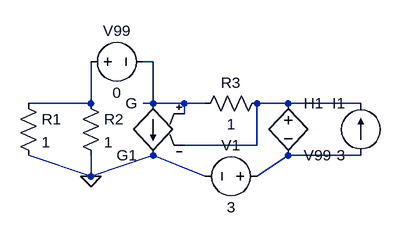
[diagram p0: schematic CCVS.asc]
CCVS.asc, the LTspice schematic file:
Version 4
SHEET 1 880 680
WIRE 208 32 192 32
WIRE 112 96 112 32
WIRE 112 96 16 96
WIRE 208 96 208 32
WIRE 208 96 192 96
WIRE 256 96 208 96
WIRE 288 96 256 96
WIRE 416 96 368 96
WIRE 528 96 416 96
WIRE 256 112 256 96
WIRE 368 160 368 96
WIRE 368 160 256 160
WIRE 528 176 416 176
WIRE 112 208 16 176
WIRE 112 208 112 176
WIRE 112 208 208 176
WIRE 288 208 208 176
WIRE 368 208 416 176
FLAG 112 208 0
SYMBOL res 0 80 R0
SYMATTR InstName R1
SYMATTR Value 1
SYMBOL res 96 80 R0
SYMATTR InstName R2
SYMATTR Value 1
SYMBOL res 384 80 R90
WINDOW 0 0 56 VBottom 2
WINDOW 3 32 56 VTop 2
SYMATTR InstName R3
SYMATTR Value 1
SYMBOL g2 208 192 R180
SYMATTR InstName G1
SYMBOL voltage 384 208 R90
WINDOW 0 -32 56 VBottom 2
WINDOW 3 32 56 VTop 2
WINDOW 123 0 0 Left 0
WINDOW 39 0 0 Left 0
SYMATTR InstName V1
SYMATTR Value 3
SYMBOL h 416 80 R0
SYMATTR InstName H1
SYMATTR Value V99
SYMATTR Value2 H
SYMBOL current 528 176 R180
WINDOW 0 24 80 Left 2
WINDOW 3 24 0 Left 2
WINDOW 123 0 0 Left 0
WINDOW 39 0 0 Left 0
SYMATTR InstName I1
SYMATTR Value 3
SYMBOL voltage 96 32 M90
WINDOW 0 -32 56 VBottom 2
WINDOW 3 32 56 VTop 2
SYMATTR InstName V99
SYMATTR Value 0

The netlist it stands for:
* CCVS.asc
R1 N002 0 1
R2 N002 0 1
R3 N003 N001 1
G1 N001 0 N001 N003 G
V1 N004 0 3
H1 N003 N004 V99 H
I1 N004 N003 3
V99 N002 N001 0
.backanno
.end